# Altium project DCAC.PrjPcb (part 7 of 11)
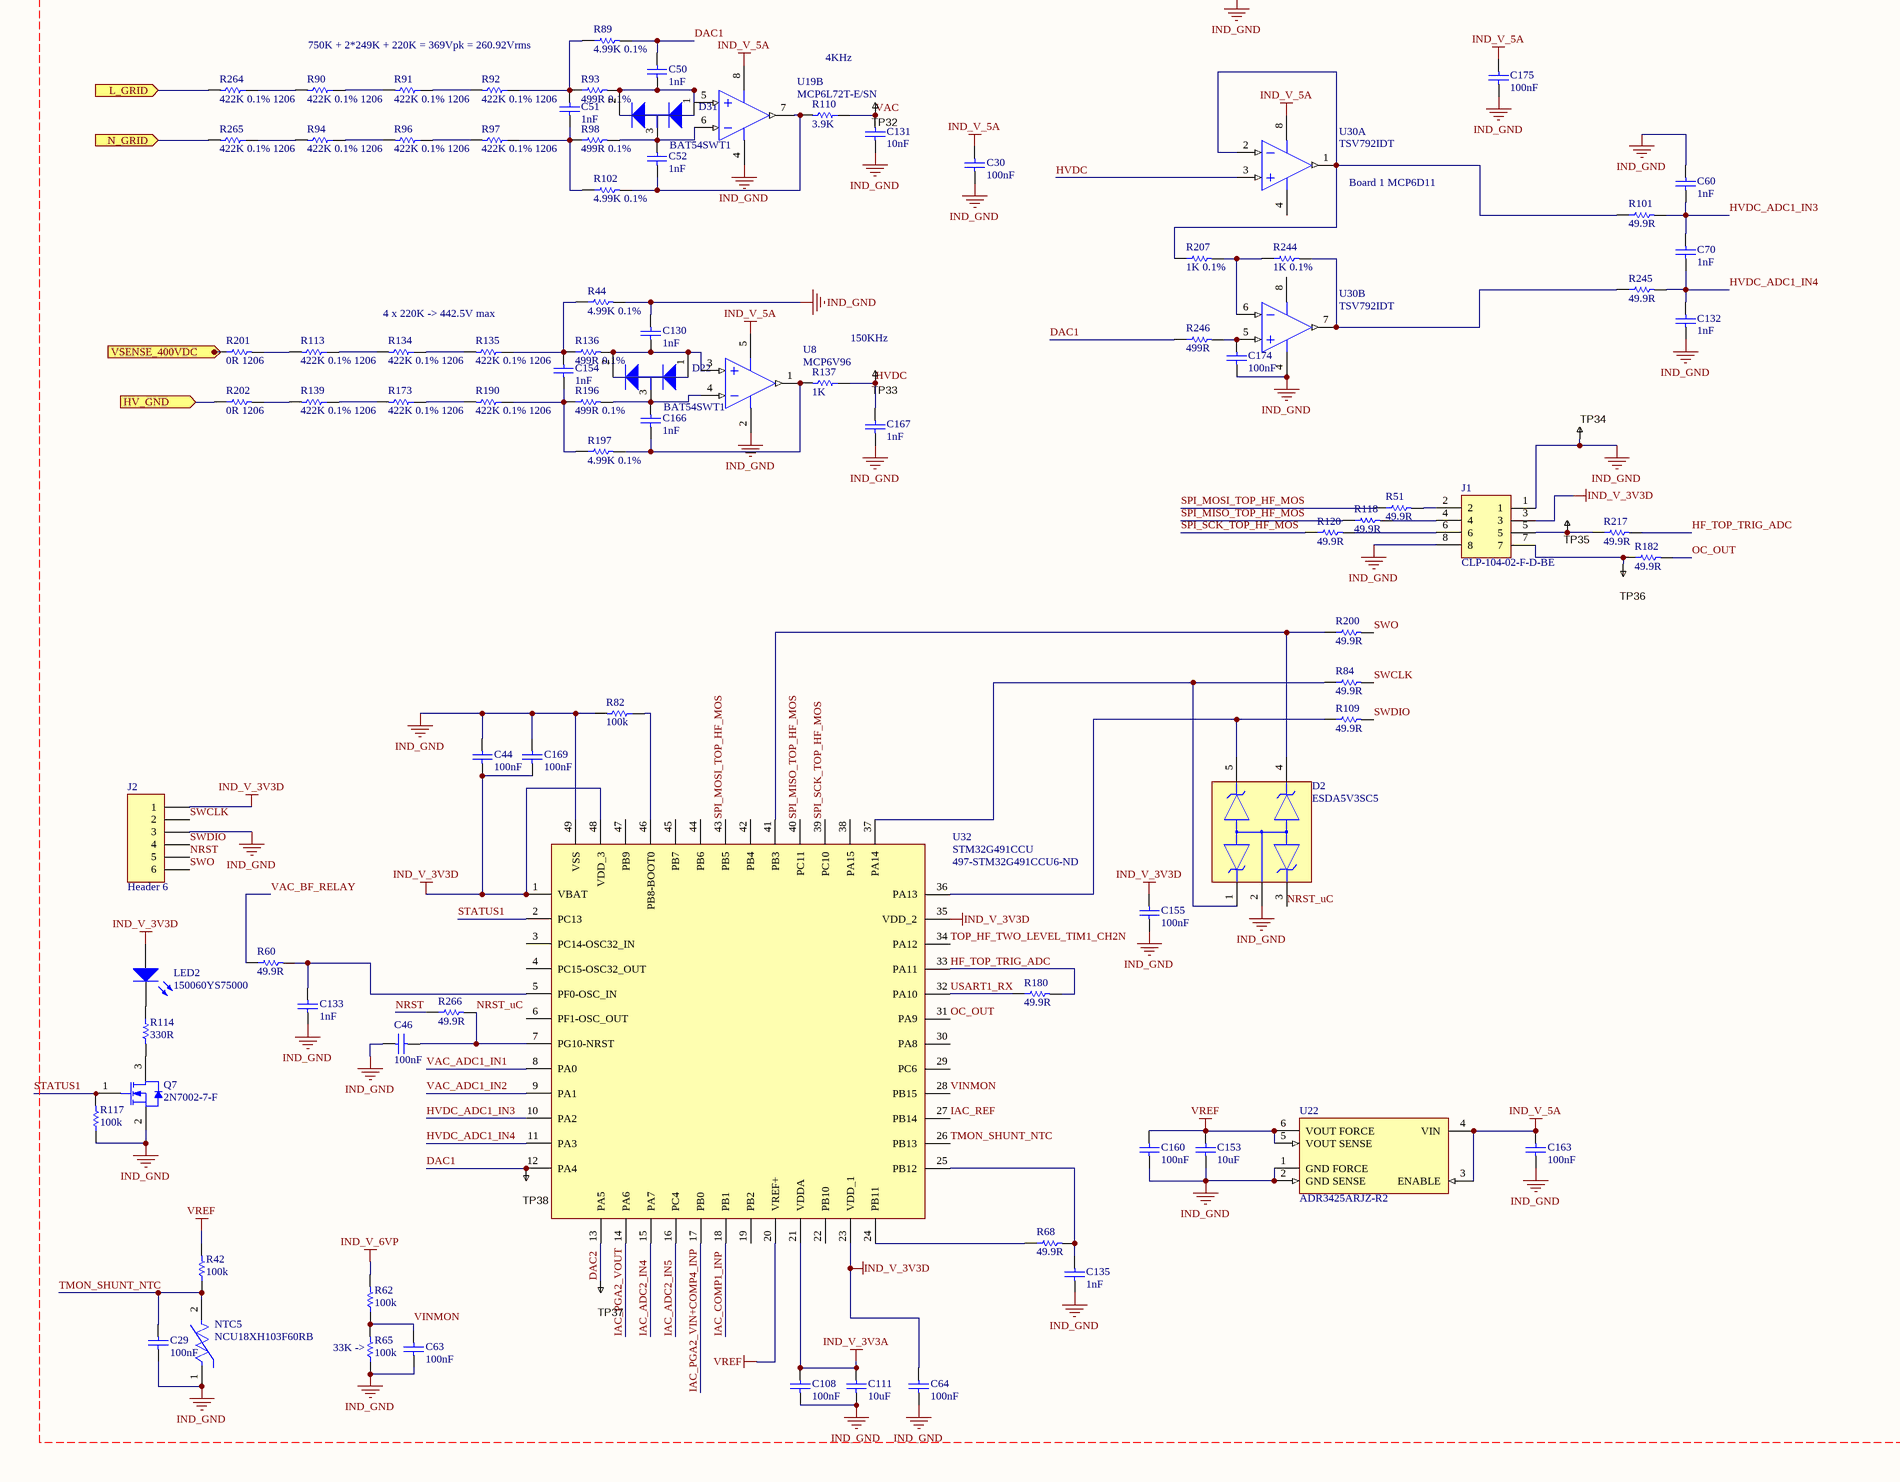
[diagram p17: IND_CURRENT_SENSE.SchDoc, bottom]

## Sheet IND_CURRENT_SENSE.SchDoc (continued)

### Library data of the parts (continued)
R40 R44 R89 R102 R194 R197 = CMP-2000-00123-1: Part Number: ERA3AEB752V; Manufacturer: Panasonic; Manufacturer Part Number: ERA-3AEB752V; Resistance: 7.5kR; Power Rating: 100mW; Temperature Coefficient: 25ppm/°C; Voltage Rating: 75V; Supplier 1: Newark; Supplier Part Number 1: 39P9989; RoHS: Yes; Category: Chip SMD Resistors; Stock 1: 4505; Pricing 1: 1=0.35700, 25=0.30700, 50=0.21600, 100=0.12400, 250=0.10000, 500=0.07500, 1000=0.05100 (USD); Mount: Surface Mount; Case/Package: 0603; Number of Pins: 2; Case Code (Metric): 1608; Case Code (Imperial): 0603; Contact Plating: Tin; Size Code: 0603; Min Operating Temperature: -55°C; Max Operating Temperature: 155°C; Packaging: Tape and Reel; Resistor Type: Thin Film; Number of Terminations: 2; Max Power Dissipation: 100mW; Series: ERA-3A; Tolerance: 0.1%; Package Quantity: 5000; Voltage Rating (DC): 75V; Resistance Tolerance: 0.1%; Termination: SMD/SMT; Construction: Rectangular; Technology: THIN FILM; Length: 1.6mm; Width: 0.8mm; Height: 0.45mm; Depth: 0.8mm; Radiation Hardening: No; RoHS Compliant: Yes; Lead Free: Lead Free; REACH SVHC: No SVHC; Military Standard: Not; ComponentLink1URL: https://datasheet.ciiva.com/29183/451204-da-01-en-widerstand-0603-era-29183801.pdf?src-supplier=Conrad; ComponentLink1Description: https://datasheet.ciiva.com/29183/451204-da-01-en-widerstand-0603-era-29183801.pdf?src-supplier=Conrad; ComponentLink2URL: https://datasheet.ciiva.com/5867/485442-5867989.pdf?src-supplier=Farnell; ComponentLink2Description: https://datasheet.ciiva.com/5867/485442-5867989.pdf?src-supplier=Farnell; ComponentLink3URL: https://datasheet.ciiva.com/30091/54aoa0000ce26-30091989.pdf?src-supplier=Onlinecomponents.com; ComponentLink3Description: https://datasheet.ciiva.com/30091/54aoa0000ce26-30091989.pdf?src-supplier=Onlinecomponents.com; ComponentLink4URL: https://datasheet.ciiva.com/46449/485442-46449462.pdf?src-supplier=Element14; ComponentLink4Description: https://datasheet.ciiva.com/46449/485442-46449462.pdf?src-supplier=Element14; ComponentLink5URL: https://datasheet.ciiva.com/16774/70068849-16774823.pdf?src-supplier=Allied+Electronics; ComponentLink5Description: https://datasheet.ciiva.com/16774/70068849-16774823.pdf?src-supplier=Allied+Electronics; ComponentLink6URL: https://datasheet.ciiva.com/5867/485442-5867992.pdf?src-supplier=Farnell; ComponentLink6Description: https://datasheet.ciiva.com/5867/485442-5867992.pdf?src-supplier=Farnell; ComponentLink7URL: https://datasheet.ciiva.com/16774/70068849-16774360.pdf?src-supplier=Allied+Electronics; ComponentLink7Description: https://datasheet.ciiva.com/16774/70068849-16774360.pdf?src-supplier=Allied+Electronics; ComponentLink8URL: https://datasheet.ciiva.com/46387/485442-46387291.pdf?src-supplier=Element14; ComponentLink8Description: https://datasheet.ciiva.com/46387/485442-46387291.pdf?src-supplier=Element14; ComponentLink9URL: https://datasheet.ciiva.com/9194/aoa0000ce26-9194812.pdf?src-supplier=Avnet; ComponentLink9Description: https://datasheet.ciiva.com/9194/aoa0000ce26-9194812.pdf?src-supplier=Avnet; ComponentLink10URL: https://datasheet.ciiva.com/46387/485442-46387292.pdf?src-supplier=Element14; ComponentLink10Description: https://datasheet.ciiva.com/46387/485442-46387292.pdf?src-supplier=Element14; ComponentLink11URL: https://datasheet.ciiva.com/17212/aoa0000ce26-17212461.pdf?src-supplier=Avnet+Europe; ComponentLink11Description: https://datasheet.ciiva.com/17212/aoa0000ce26-17212461.pdf?src-supplier=Avnet+Europe; ComponentLink12URL: https://datasheet.ciiva.com/22740/485442-22740941.pdf?src-supplier=Element14; ComponentLink12Description: https://datasheet.ciiva.com/22740/485442-22740941.pdf?src-supplier=Element14; ComponentLink13URL: https://datasheet.ciiva.com/16395/aoa0000ce26-16395263.pdf?src-supplier=Future+Electronics; ComponentLink13Description: https://datasheet.ciiva.com/16395/aoa0000ce26-16395263.pdf?src-supplier=Future+Electronics
R42 R62 R65 R82 = CMP-2000-00182-1: ±1% 100kΩ ±100ppm/℃ 0.1W 0603 Chip Resistor - Surface Mount ROHS; Part Number: ERJ-3EKF1003V; Manufacturer: Panasonic; Manufacturer Part Number: ERJ3EKF1003V; Resistance: 100kR; Power Rating: 100mW; Temperature Coefficient: 100ppm/°C; Voltage Rating: 75V; Supplier 1: Digi-Key; Supplier Part Number 1: P100KHCT-ND; RoHS: Yes; Category: Chip SMD Resistors; Stock 1: 2532776; Pricing 1: 1=0.10000, 10=0.05700, 100=0.02340, 1000=0.01049, 2500=0.00911 (USD); Mount: Surface Mount; Case/Package: 0603; Number of Pins: 2; Weight: 7.1E-05oz; Case Code (Imperial): 0603; Case Code (Metric): 1608; Contact Plating: Tin; Min Operating Temperature: -55°C; Max Operating Temperature: 155°C; Tolerance: 1%; Packaging: Tape and Reel; Composition: Thick Film; Termination: SMD/SMT; Package Quantity: 5000; Number of Terminations: 2; Max Power Dissipation: 100mW; Military Standard: Not; Voltage Rating (DC): 75V; Features: Automotive AEC-Q200; Length: 1.6mm; Height: 0.022inch; Width: 0.8mm; Depth: 0.8mm; Radiation Hardening: No; Lead Free: Lead Free; REACH SVHC: No SVHC; ComponentLink1URL: https://datasheet.ciiva.com/34303/1987476-34303566.pdf?src-supplier=Jameco; ComponentLink1Description: https://datasheet.ciiva.com/34303/1987476-34303566.pdf?src-supplier=Jameco; ComponentLink2URL: https://datasheet.ciiva.com/30133/aoa0000ce2-30133845.pdf?src-supplier=Onlinecomponents.com; ComponentLink2Description: https://datasheet.ciiva.com/30133/aoa0000ce2-30133845.pdf?src-supplier=Onlinecomponents.com; ComponentLink3URL: https://datasheet.ciiva.com/15158/getdatasheetpartid-247527-15158907.pdf?src-supplier=Verical; ComponentLink3Description: https://datasheet.ciiva.com/15158/getdatasheetpartid-247527-15158907.pdf?src-supplier=Verical; ComponentLink4URL: https://datasheet.ciiva.com/16770/70260748-16770253.pdf?src-supplier=Allied+Electronics; ComponentLink4Description: https://datasheet.ciiva.com/16770/70260748-16770253.pdf?src-supplier=Allied+Electronics; ComponentLink5URL: https://datasheet.ciiva.com/16740/aoa0000ce2-16740662.pdf?src-supplier=Future+Electronics; ComponentLink5Description: https://datasheet.ciiva.com/16740/aoa0000ce2-16740662.pdf?src-supplier=Future+Electronics; Supplier 2: Newark; Supplier Part Number 2: 85Y8503; Stock 2: 3015148; Pricing 2: 5000=0.02500, 10000=0.02400, 20000=0.01800 (USD); Size Code: 0603; Resistor Type: Thick Film; Series: ERJ; Resistance Tolerance: 1%; Construction: Rectangular; RoHS Compliant: Yes; JLCPCB Part #: C25803
R45-R47 R52 R56 R80 R90-R92 R94 R96 R97 R113 R134 R135 R139 R173 R190 = CMP-1014-00867-1: 1M5 0.25W 1% 1206 (3216 Metric)  SMD; Manufacturer: Yageo; Manufacturer Part Number: RT1206BRD07422KL; Case-EIA: 1206; Value: 1500000.00 Ohm; Case-Metric: 3216; Resistance: 422kR; Temperature Coefficient: 25ppm/°C; Power Rating: 250mW; Voltage Rating: 200V; Tolerance: 1 %; Power: 0.25 W; Technology: SMT; Supplier 1: Avnet; Supplier Part Number 1: RT1206BRD07422KL; RoHS: Yes; Category: Chip SMD Resistors; Pricing 1: 5000=0.04959, 10000=0.04889, 20000=0.04749, 30000=0.04644, 40000=0.04470, 50000=0.04365, 500000=0.04260 (USD); Case/Package: 1206; Case Code (Metric): 3216; Case Code (Imperial): 1206; Min Operating Temperature: -55°C; Max Operating Temperature: 125°C; Packaging: Tape and Reel; Series: RT; Number of Terminations: 2; Package Quantity: 5000; Max Power Dissipation: 250mW; Resistor Type: Thin Film; Termination: SMD/SMT; Voltage Rating (DC): 200V; Length: 0.122inch; Width: 0.063inch; Height: 0.026inch; RoHS Compliant: Yes; Lead Free: Lead Free; ComponentLink1URL: https://datasheet.ciiva.com/2587/pyu-rt-1-to-0-05-rohs-l-5-2587699.pdf?src-supplier=Digi-Key; ComponentLink1Description: https://datasheet.ciiva.com/2587/pyu-rt-1-to-0-05-rohs-l-5-2587699.pdf?src-supplier=Digi-Key; ComponentLink2URL: https://datasheet.ciiva.com/12702/pyu-rt-1-to-0-05-rohs-l-4-12702650.pdf?src-supplier=Mouser; ComponentLink2Description: https://datasheet.ciiva.com/12702/pyu-rt-1-to-0-05-rohs-l-4-12702650.pdf?src-supplier=Mouser
R49 R83 R93 R98 R136 R196 = CMP-2000-00076-1: Res Thin Film 0603 499 Ohm 0.1% 1/10W ±25ppm/°C Molded SMD SMD Punched Carrier T/R; Part Number: ERA3AEB4990V; Manufacturer: Panasonic; Manufacturer Part Number: ERA-3AEB4990V; Power Rating: 100mW; Voltage Rating: 150V; Voltage Rating (DC): 75V; Supplier 1: Digi-Key; Supplier Part Number 1: P499DBCT-ND; RoHS: Yes; Category: Chip SMD Resistors; Stock 1: 51561; Pricing 1: 1=0.31000, 10=0.26000, 100=0.10150, 1000=0.04248, 2500=0.03894 (USD); Mount: Surface Mount; Case/Package: 0603; Number of Pins: 2; Case Code (Metric): 1608; Case Code (Imperial): 0603; Contact Plating: Tin; Min Operating Temperature: -55°C; Max Operating Temperature: 155°C; Resistance: 499R; Tolerance: 0.1%; Packaging: Tape and Reel; Resistor Type: Thin Film,Metal Film; Temperature Coefficient: 25ppm/°C; Package Quantity: 1; Number of Terminations: 2; Termination: SMD/SMT; Max Power Dissipation: 100mW; Series: ERA-3A; Resistance Tolerance: 0.1%; Construction: Rectangular; Features: Automotive AEC-Q200; Technology: METAL FILM; Length: 1.6mm; Width: 0.8mm; Height: 0.45mm; Depth: 0.8mm; Radiation Hardening: No; RoHS Compliant: Yes; Lead Free: Lead Free; REACH SVHC: No SVHC; Military Standard: Not; ComponentLink1URL: https://datasheet.ciiva.com/11810/0900766b80eb1d8c-11810911.pdf?src-supplier=RSComponents; ComponentLink1Description: https://datasheet.ciiva.com/11810/0900766b80eb1d8c-11810911.pdf?src-supplier=RSComponents; ComponentLink2URL: https://datasheet.ciiva.com/29183/451973-da-01-en-widerstand-0603-era-29183924.pdf?src-supplier=Conrad; ComponentLink2Description: https://datasheet.ciiva.com/29183/451973-da-01-en-widerstand-0603-era-29183924.pdf?src-supplier=Conrad; ComponentLink3URL: https://datasheet.ciiva.com/9181/aoa0000ce26-9181477.pdf?src-supplier=Avnet; ComponentLink3Description: https://datasheet.ciiva.com/9181/aoa0000ce26-9181477.pdf?src-supplier=Avnet; ComponentLink4URL: https://datasheet.ciiva.com/17205/aoa0000ce26-17205477.pdf?src-supplier=Avnet+Europe; ComponentLink4Description: https://datasheet.ciiva.com/17205/aoa0000ce26-17205477.pdf?src-supplier=Avnet+Europe; ComponentLink5URL: https://datasheet.ciiva.com/30161/54aoa0000ce26-30161593.pdf?src-supplier=Onlinecomponents.com; ComponentLink5Description: https://datasheet.ciiva.com/30161/54aoa0000ce26-30161593.pdf?src-supplier=Onlinecomponents.com; ComponentLink6URL: https://datasheet.ciiva.com/7920/485442-7920378.pdf?src-supplier=Element14; ComponentLink6Description: https://datasheet.ciiva.com/7920/485442-7920378.pdf?src-supplier=Element14; ComponentLink7URL: https://datasheet.ciiva.com/7920/485442-7920379.pdf?src-supplier=Element14; ComponentLink7Description: https://datasheet.ciiva.com/7920/485442-7920379.pdf?src-supplier=Element14; ComponentLink8URL: https://datasheet.ciiva.com/6201/485442-6201036.pdf?src-supplier=Farnell; ComponentLink8Description: https://datasheet.ciiva.com/6201/485442-6201036.pdf?src-supplier=Farnell
R58 R77 = RES: Resistor, SMD 30 kOhm 0603  ±  0.1 %, ERA3AEB303V, Panasonic Automotive & Industrial Systems; Manufacturer Part Number: ERA-3AEB303V; Power Rating: 100mW; Voltage Rating: 75V; Resistance: 30kR; Temperature Coefficient: 25ppm/°C; Manufacturer: Panasonic; Part Number: ERA3AEB303V; Supplier 1: Avnet; Supplier Part Number 1: ERA-3AEB303V; RoHS: Yes; Category: Chip SMD Resistors; Stock 1: 26; Pricing 1: 1=0.03536, 157=0.03482, 313=0.03427, 625=0.03373, 1250=0.03318, 2500=0.03264, 5000=0.03210 (USD); Mount: Surface Mount; Case/Package: 0603; Number of Pins: 2; Case Code (Metric): 1608; Case Code (Imperial): 0603; Size Code: 0603; Contact Plating: Tin; Min Operating Temperature: -55°C; Max Operating Temperature: 155°C; Tolerance: 0.1%; Packaging: Tape and Reel; Resistor Type: Thin Film; Series: ERA-3A; Termination: SMD/SMT; Number of Terminations: 2; Max Power Dissipation: 100mW; Features: Automotive AEC-Q200; Package Quantity: 1; Resistance Tolerance: 0.1%; Construction: Rectangular; Technology: THIN FILM; Length: 1.6mm; Width: 0.8mm; Height: 0.45mm; Depth: 0.8mm; Radiation Hardening: No; RoHS Compliant: Yes; REACH SVHC: No SVHC; Military Standard: Not; ComponentLink1URL: https://datasheet.ciiva.com/29183/451408-da-01-en-widerstand-0603-era-29183835.pdf?src-supplier=Conrad; ComponentLink1Description: https://datasheet.ciiva.com/29183/451408-da-01-en-widerstand-0603-era-29183835.pdf?src-supplier=Conrad; ComponentLink2URL: https://datasheet.ciiva.com/5917/485442-5917669.pdf?src-supplier=Farnell; ComponentLink2Description: https://datasheet.ciiva.com/5917/485442-5917669.pdf?src-supplier=Farnell; ComponentLink3URL: https://datasheet.ciiva.com/16212/aoa0000ce26-16212101.pdf?src-supplier=Future+Electronics; ComponentLink3Description: https://datasheet.ciiva.com/16212/aoa0000ce26-16212101.pdf?src-supplier=Future+Electronics; ComponentLink4URL: https://datasheet.ciiva.com/43455/485442-43455381.pdf?src-supplier=Farnell; ComponentLink4Description: https://datasheet.ciiva.com/43455/485442-43455381.pdf?src-supplier=Farnell; ComponentLink5URL: https://datasheet.ciiva.com/30073/54aoa0000ce26-30073910.pdf?src-supplier=Onlinecomponents.com; ComponentLink5Description: https://datasheet.ciiva.com/30073/54aoa0000ce26-30073910.pdf?src-supplier=Onlinecomponents.com; ComponentLink6URL: https://datasheet.ciiva.com/9190/aoa0000ce26-9190919.pdf?src-supplier=Avnet; ComponentLink6Description: https://datasheet.ciiva.com/9190/aoa0000ce26-9190919.pdf?src-supplier=Avnet; ComponentLink7URL: https://datasheet.ciiva.com/16759/70068849-16759447.pdf?src-supplier=Allied+Electronics; ComponentLink7Description: https://datasheet.ciiva.com/16759/70068849-16759447.pdf?src-supplier=Allied+Electronics; ComponentLink8URL: https://datasheet.ciiva.com/17210/aoa0000ce26-17210455.pdf?src-supplier=Avnet+Europe; ComponentLink8Description: https://datasheet.ciiva.com/17210/aoa0000ce26-17210455.pdf?src-supplier=Avnet+Europe; ComponentLink9URL: https://datasheet.ciiva.com/22740/485442-22740936.pdf?src-supplier=Element14; ComponentLink9Description: https://datasheet.ciiva.com/22740/485442-22740936.pdf?src-supplier=Element14; ComponentLink10URL: https://datasheet.ciiva.com/43457/485442-43457880.pdf?src-supplier=Farnell; ComponentLink10Description: https://datasheet.ciiva.com/43457/485442-43457880.pdf?src-supplier=Farnell; ComponentLink11URL: https://datasheet.ciiva.com/48425/era-eng-tds-48425453.pdf?src-supplier=Distrelec; ComponentLink11Description: https://datasheet.ciiva.com/48425/era-eng-tds-48425453.pdf?src-supplier=Distrelec
R59 R110 R254 = RES: ±1% 3.9kΩ ±100ppm/℃ 0.1W 0603 Chip Resistor - Surface Mount ROHS; Part Number: ERJ-3EKF1001V; Manufacturer: Panasonic; Manufacturer Part Number: ERJ3EKF1001V; Resistance: 1kR; Power Rating: 100mW; Voltage Rating: 75V; Temperature Coefficient: 100ppm/°C; Supplier 1: Future Electronics; Supplier Part Number 1: 3028514; RoHS: Yes; Category: Chip SMD Resistors; Stock 1: 430000; Pricing 1: 5000=0.01860, 10000=0.01510, 15000=0.01500, 20000=0.01490 (USD); Mount: Surface Mount; Case/Package: 0603; Number of Pins: 2; Case Code (Metric): 1608; Case Code (Imperial): 0603; Contact Plating: Tin; Size Code: 0603; Min Operating Temperature: -55°C; Max Operating Temperature: 155°C; Packaging: Tape and Reel; Tolerance: 1%; Termination: SMD/SMT; Package Quantity: 5000; Series: ERJ; Resistor Type: Thick Film; Max Power Dissipation: 100mW; Construction: Rectangular; Resistance Tolerance: 1%; Number of Terminations: 2; Features: Automotive AEC-Q200; Voltage Rating (DC): 75V; Technology: THICK FILM; Length: 1.6mm; Width: 0.8mm; Height: 0.45mm; Depth: 0.8mm; Radiation Hardening: No; REACH SVHC: No SVHC; Lead Free: Lead Free; RoHS Compliant: Yes; Military Standard: Not; ComponentLink1URL: https://datasheet.ciiva.com/16768/70260748-16768437.pdf?src-supplier=Allied+Electronics; ComponentLink1Description: https://datasheet.ciiva.com/16768/70260748-16768437.pdf?src-supplier=Allied+Electronics; ComponentLink2URL: https://datasheet.ciiva.com/16774/70260748-16774550.pdf?src-supplier=Allied+Electronics; ComponentLink2Description: https://datasheet.ciiva.com/16774/70260748-16774550.pdf?src-supplier=Allied+Electronics; ComponentLink3URL: https://datasheet.ciiva.com/16449/aoa0000ce2-16449065.pdf?src-supplier=Future+Electronics; ComponentLink3Description: https://datasheet.ciiva.com/16449/aoa0000ce2-16449065.pdf?src-supplier=Future+Electronics; ComponentLink4URL: https://datasheet.ciiva.com/7942/aoa0000ce2-7942427.pdf?src-supplier=Element14; ComponentLink4Description: https://datasheet.ciiva.com/7942/aoa0000ce2-7942427.pdf?src-supplier=Element14; ComponentLink5URL: https://datasheet.ciiva.com/9198/aoa0000ce2-9198923.pdf?src-supplier=Avnet; ComponentLink5Description: https://datasheet.ciiva.com/9198/aoa0000ce2-9198923.pdf?src-supplier=Avnet; ComponentLink6URL: https://datasheet.ciiva.com/46373/1678782-46373339.pdf?src-supplier=Element14; ComponentLink6Description: https://datasheet.ciiva.com/46373/1678782-46373339.pdf?src-supplier=Element14; ComponentLink7URL: https://datasheet.ciiva.com/48530/aoa0000ce2-48530987.pdf?src-supplier=Avnet; ComponentLink7Description: https://datasheet.ciiva.com/48530/aoa0000ce2-48530987.pdf?src-supplier=Avnet; ComponentLink8URL: https://datasheet.ciiva.com/46373/1678782-46373340.pdf?src-supplier=Element14; ComponentLink8Description: https://datasheet.ciiva.com/46373/1678782-46373340.pdf?src-supplier=Element14; ComponentLink9URL: https://datasheet.ciiva.com/24070/aoa0000ce2-24070269.pdf?src-supplier=Mouser; ComponentLink9Description: https://datasheet.ciiva.com/24070/aoa0000ce2-24070269.pdf?src-supplier=Mouser; ComponentLink10URL: https://datasheet.ciiva.com/22673/1678782-22673918.pdf?src-supplier=Element14; ComponentLink10Description: https://datasheet.ciiva.com/22673/1678782-22673918.pdf?src-supplier=Element14; ComponentLink11URL: https://datasheet.ciiva.com/30063/aoa0000ce2-30063390.pdf?src-supplier=Onlinecomponents.com; ComponentLink11Description: https://datasheet.ciiva.com/30063/aoa0000ce2-30063390.pdf?src-supplier=Onlinecomponents.com; ComponentLink12URL: https://datasheet.ciiva.com/17215/aoa0000ce2-17215311.pdf?src-supplier=Avnet+Europe; ComponentLink12Description: https://datasheet.ciiva.com/17215/aoa0000ce2-17215311.pdf?src-supplier=Avnet+Europe; Parameter 1: *; JLCPCB Part #: C23018
R64 R75 = RES: Res Thin Film 0603 499 Ohm 0.1% 1/10W ±25ppm/°C Molded SMD SMD Punched Carrier T/R; Part Number: ERA3AEB4990V; Manufacturer: Panasonic; Manufacturer Part Number: ERA-3AEB4990V; Power Rating: 100mW; Voltage Rating: 150V; Voltage Rating (DC): 75V; Supplier 1: Digi-Key; Supplier Part Number 1: P499DBCT-ND; RoHS: Yes; Category: Chip SMD Resistors; Stock 1: 51561; Pricing 1: 1=0.31000, 10=0.26000, 100=0.10150, 1000=0.04248, 2500=0.03894 (USD); Mount: Surface Mount; Case/Package: 0603; Number of Pins: 2; Case Code (Metric): 1608; Case Code (Imperial): 0603; Contact Plating: Tin; Min Operating Temperature: -55°C; Max Operating Temperature: 155°C; Resistance: 499R; Tolerance: 0.1%; Packaging: Tape and Reel; Resistor Type: Thin Film,Metal Film; Temperature Coefficient: 25ppm/°C; Package Quantity: 1; Number of Terminations: 2; Termination: SMD/SMT; Max Power Dissipation: 100mW; Series: ERA-3A; Resistance Tolerance: 0.1%; Construction: Rectangular; Features: Automotive AEC-Q200; Technology: METAL FILM; Length: 1.6mm; Width: 0.8mm; Height: 0.45mm; Depth: 0.8mm; Radiation Hardening: No; RoHS Compliant: Yes; Lead Free: Lead Free; REACH SVHC: No SVHC; Military Standard: Not; ComponentLink1URL: https://datasheet.ciiva.com/11810/0900766b80eb1d8c-11810911.pdf?src-supplier=RSComponents; ComponentLink1Description: https://datasheet.ciiva.com/11810/0900766b80eb1d8c-11810911.pdf?src-supplier=RSComponents; ComponentLink2URL: https://datasheet.ciiva.com/29183/451973-da-01-en-widerstand-0603-era-29183924.pdf?src-supplier=Conrad; ComponentLink2Description: https://datasheet.ciiva.com/29183/451973-da-01-en-widerstand-0603-era-29183924.pdf?src-supplier=Conrad; ComponentLink3URL: https://datasheet.ciiva.com/9181/aoa0000ce26-9181477.pdf?src-supplier=Avnet; ComponentLink3Description: https://datasheet.ciiva.com/9181/aoa0000ce26-9181477.pdf?src-supplier=Avnet; ComponentLink4URL: https://datasheet.ciiva.com/17205/aoa0000ce26-17205477.pdf?src-supplier=Avnet+Europe; ComponentLink4Description: https://datasheet.ciiva.com/17205/aoa0000ce26-17205477.pdf?src-supplier=Avnet+Europe; ComponentLink5URL: https://datasheet.ciiva.com/30161/54aoa0000ce26-30161593.pdf?src-supplier=Onlinecomponents.com; ComponentLink5Description: https://datasheet.ciiva.com/30161/54aoa0000ce26-30161593.pdf?src-supplier=Onlinecomponents.com; ComponentLink6URL: https://datasheet.ciiva.com/7920/485442-7920378.pdf?src-supplier=Element14; ComponentLink6Description: https://datasheet.ciiva.com/7920/485442-7920378.pdf?src-supplier=Element14; ComponentLink7URL: https://datasheet.ciiva.com/7920/485442-7920379.pdf?src-supplier=Element14; ComponentLink7Description: https://datasheet.ciiva.com/7920/485442-7920379.pdf?src-supplier=Element14; ComponentLink8URL: https://datasheet.ciiva.com/6201/485442-6201036.pdf?src-supplier=Farnell; ComponentLink8Description: https://datasheet.ciiva.com/6201/485442-6201036.pdf?src-supplier=Farnell
R114 = RES-2: ±1% 330Ω ±100ppm/℃ 0.1W 0603 Chip Resistor - Surface Mount ROHS; Manufacturer: Yageo; Manufacturer Part Number: RC0603FR-07330RL; Tolerance: 10%; ESR: 800 mohm; Voltage Rating (DC): 16 V; Capacitance: 47 uF; Temperature Coefficient: 100ppm/°C; Power Rating: 100mW; Length: 7.3 mm; ComponentLink1URL: http://www.yageo.com/; Packaging: Tape and Reel; Pins: 2; ComponentLink1Description: Manufacturer URL; Case Code (Imperial): 2917; REACH SVHC: No SVHC; Width: 4.3 mm; ComponentLink2Description: Datasheet; Voltage Rating: 16 V; RoHSCompliant: True; Max Operating Temperature: 125degC; ComponentLink2URL: http://www.yageo.com/documents/recent/PYu-RC_Group_51_RoHS_L_04.pdf; Min Operating Temperature: -55degC; Case/Package: 2917; Radiation Hardening: No; DatasheetVersion: Rev. 4, 02/2016; Mount: Surface Mount; PackageReference: 0603; Package Quantity: 500; Case Code (Metric): 7343; PackageDescription: 2-Pin Surface Mount Device, Body 1.6 x 0.8 mm; Height: 3.1 mm; Supplier 1: Digi-Key; Supplier Part Number 1: 311-330HRCT-ND; RoHS: Yes; Category: Chip SMD Resistors; Stock 1: 4209654; Pricing 1: 1=0.10000, 10=0.02300, 100=0.00940, 1000=0.00421, 2500=0.00366 (USD); Number of Pins: 2; Composition: Thick Film; Resistance: 330R; Number of Terminations: 2; Max Power Dissipation: 100mW; Termination: SMD/SMT; Features: Moisture Resistant; Depth: 0.8mm; Lead Free: Lead Free; ComponentLink3URL: https://datasheet.ciiva.com/11819/0900766b80f96399-11819327.pdf?src-supplier=RSComponents; ComponentLink3Description: https://datasheet.ciiva.com/11819/0900766b80f96399-11819327.pdf?src-supplier=RSComponents; ComponentLink4URL: https://datasheet.ciiva.com/2454/pyu-r-int-thick-7-2454864.pdf?src-supplier=Digi-Key; ComponentLink4Description: https://datasheet.ciiva.com/2454/pyu-r-int-thick-7-2454864.pdf?src-supplier=Digi-Key; ComponentLink5URL: https://datasheet.ciiva.com/2454/pyu-r-int-thick-7-2454865.pdf?src-supplier=Digi-Key; ComponentLink5Description: https://datasheet.ciiva.com/2454/pyu-r-int-thick-7-2454865.pdf?src-supplier=Digi-Key; ComponentLink6URL: https://datasheet.ciiva.com/2454/pyu-r-int-thick-7-2454866.pdf?src-supplier=Digi-Key; ComponentLink6Description: https://datasheet.ciiva.com/2454/pyu-r-int-thick-7-2454866.pdf?src-supplier=Digi-Key; ComponentLink7URL: https://datasheet.ciiva.com/12555/rc0603-272842-12555334.pdf?src-supplier=Mouser; ComponentLink7Description: https://datasheet.ciiva.com/12555/rc0603-272842-12555334.pdf?src-supplier=Mouser; ComponentLink8URL: https://datasheet.ciiva.com/46440/1868787-46440904.pdf?src-supplier=Element14; ComponentLink8Description: https://datasheet.ciiva.com/46440/1868787-46440904.pdf?src-supplier=Element14; ComponentLink9URL: https://datasheet.ciiva.com/7746/443971-7746329.pdf?src-supplier=Element14; ComponentLink9Description: https://datasheet.ciiva.com/7746/443971-7746329.pdf?src-supplier=Element14; ComponentLink10URL: https://datasheet.ciiva.com/7746/443971-7746330.pdf?src-supplier=Element14; ComponentLink10Description: https://datasheet.ciiva.com/7746/443971-7746330.pdf?src-supplier=Element14; ComponentLink11URL: https://datasheet.ciiva.com/7746/1686128-7746331.pdf?src-supplier=Element14; ComponentLink11Description: https://datasheet.ciiva.com/7746/1686128-7746331.pdf?src-supplier=Element14; Parameter 1: *; JLCPCB Part #: C23138
R117 = RES: ±1% 100kΩ ±100ppm/℃ 0.1W 0603 Chip Resistor - Surface Mount ROHS; Part Number: ERJ-3EKF1003V; Manufacturer: Panasonic; Manufacturer Part Number: ERJ3EKF1003V; Resistance: 100kR; Power Rating: 100mW; Temperature Coefficient: 100ppm/°C; Voltage Rating: 75V; Supplier 1: Digi-Key; Supplier Part Number 1: P100KHCT-ND; RoHS: Yes; Category: Chip SMD Resistors; Stock 1: 2532776; Pricing 1: 1=0.10000, 10=0.05700, 100=0.02340, 1000=0.01049, 2500=0.00911 (USD); Mount: Surface Mount; Case/Package: 0603; Number of Pins: 2; Weight: 7.1E-05oz; Case Code (Imperial): 0603; Case Code (Metric): 1608; Contact Plating: Tin; Min Operating Temperature: -55°C; Max Operating Temperature: 155°C; Tolerance: 1%; Packaging: Tape and Reel; Composition: Thick Film; Termination: SMD/SMT; Package Quantity: 5000; Number of Terminations: 2; Max Power Dissipation: 100mW; Military Standard: Not; Voltage Rating (DC): 75V; Features: Automotive AEC-Q200; Length: 1.6mm; Height: 0.022inch; Width: 0.8mm; Depth: 0.8mm; Radiation Hardening: No; Lead Free: Lead Free; REACH SVHC: No SVHC; ComponentLink1URL: https://datasheet.ciiva.com/34303/1987476-34303566.pdf?src-supplier=Jameco; ComponentLink1Description: https://datasheet.ciiva.com/34303/1987476-34303566.pdf?src-supplier=Jameco; ComponentLink2URL: https://datasheet.ciiva.com/30133/aoa0000ce2-30133845.pdf?src-supplier=Onlinecomponents.com; ComponentLink2Description: https://datasheet.ciiva.com/30133/aoa0000ce2-30133845.pdf?src-supplier=Onlinecomponents.com; ComponentLink3URL: https://datasheet.ciiva.com/15158/getdatasheetpartid-247527-15158907.pdf?src-supplier=Verical; ComponentLink3Description: https://datasheet.ciiva.com/15158/getdatasheetpartid-247527-15158907.pdf?src-supplier=Verical; ComponentLink4URL: https://datasheet.ciiva.com/16770/70260748-16770253.pdf?src-supplier=Allied+Electronics; ComponentLink4Description: https://datasheet.ciiva.com/16770/70260748-16770253.pdf?src-supplier=Allied+Electronics; ComponentLink5URL: https://datasheet.ciiva.com/16740/aoa0000ce2-16740662.pdf?src-supplier=Future+Electronics; ComponentLink5Description: https://datasheet.ciiva.com/16740/aoa0000ce2-16740662.pdf?src-supplier=Future+Electronics; Supplier 2: Newark; Supplier Part Number 2: 85Y8503; Stock 2: 3015148; Pricing 2: 5000=0.02500, 10000=0.02400, 20000=0.01800 (USD); Size Code: 0603; Resistor Type: Thick Film; Series: ERJ; Resistance Tolerance: 1%; Construction: Rectangular; RoHS Compliant: Yes; JLCPCB Part #: C25803
R201 R202 = CMP-2003-00541-1: Manufacturer: Panasonic; Part Number: ERJ-8GEY0R00V
R204 = RES: RES SMD 1K OHM 0.1% 1/10W 0603; Part Number: RT0603BRE071KL; Manufacturer: Yageo; Resistance: 1kR; Power Rating: 100mW; Temperature Coefficient: 50ppm/°C; Voltage Rating (DC): 50V; Supplier 1: Digi-Key; Supplier Part Number 1: YAG2314CT-ND; Manufacturer Part Number: RT0603BRE071KL; RoHS: Yes; Category: Chip SMD Resistors; Stock 1: 173; Pricing 1: 1=0.38000, 10=0.27500, 100=0.11000, 1000=0.05420, 2500=0.05021 (USD); Case/Package: 0603; Case Code (Metric): 1608; Case Code (Imperial): 0603; Size Code: 0603; Min Operating Temperature: -55°C; Max Operating Temperature: 155°C; Packaging: Tape and Reel; Resistor Type: Thin Film; Tolerance: 0.1%; Number of Terminations: 2; Series: RT; Max Power Dissipation: 100mW; Construction: Rectangular; Package Quantity: 5000; Features: Moisture Resistant; Length: 0.063inch; Width: 0.031inch; Height: 0.022inch; Depth: 0.8mm; RoHS Compliant: Yes; Military Standard: Not; Lead Free: Lead Free; ComponentLink1URL: https://datasheet.ciiva.com/2584/pyu-rt-1-to-0-05-rohs-l-5-2584317.pdf?src-supplier=Digi-Key; ComponentLink1Description: https://datasheet.ciiva.com/2584/pyu-rt-1-to-0-05-rohs-l-5-2584317.pdf?src-supplier=Digi-Key
R255 = RES: ±1% ±200ppm/℃ 0.1W 49.9Ω 0603 Chip Resistor - Surface Mount ROHS; Manufacturer: Panasonic; Part Number: ERJ-3EKF49R9V; Manufacturer Part Number: ERJ3EKF49R9V; Power Rating: 100mW; Voltage Rating: 75V; Temperature Coefficient: 100ppm/°C; Voltage Rating (DC): 50V; Working Voltage: 6V; Supplier 1: RSComponents; Supplier Part Number 1: 1229343; RoHS: Yes; Category: Chip SMD Resistors; Stock 1: 1; Pricing 1: 5000=0.00700 (USD); Mount: Surface Mount; Case/Package: 0603; Case Code (Imperial): 0603; Case Code (Metric): 1608; Contact Plating: Tin; Min Operating Temperature: -55°C; Max Operating Temperature: 155°C; Packaging: Tape and Reel; Resistance: 49.9R; Tolerance: 1%; Resistor Type: Thick Film; Number of Terminations: 2; Termination: SMD/SMT; Max Power Dissipation: 100mW; Series: ERJ; Package Quantity: 5000; Resistance Tolerance: 1%; Features: Automotive AEC-Q200; Construction: Rectangular; Technology: THICK FILM; Length: 1.6mm; Width: 0.8mm; Height: 0.022inch; Depth: 0.8mm; Radiation Hardening: No; REACH SVHC: Unknown; Lead Free: Lead Free; RoHS Compliant: Yes; Military Standard: Not; ComponentLink1URL: https://datasheet.ciiva.com/46388/1678782-46388908.pdf?src-supplier=Element14; ComponentLink1Description: https://datasheet.ciiva.com/46388/1678782-46388908.pdf?src-supplier=Element14; ComponentLink2URL: https://datasheet.ciiva.com/28694/1678782-28694219.pdf?src-supplier=Element14; ComponentLink2Description: https://datasheet.ciiva.com/28694/1678782-28694219.pdf?src-supplier=Element14; ComponentLink3URL: https://datasheet.ciiva.com/16772/70260748-16772570.pdf?src-supplier=Allied+Electronics; ComponentLink3Description: https://datasheet.ciiva.com/16772/70260748-16772570.pdf?src-supplier=Allied+Electronics; ComponentLink4URL: https://datasheet.ciiva.com/16766/70260748-16766262.pdf?src-supplier=Allied+Electronics; ComponentLink4Description: https://datasheet.ciiva.com/16766/70260748-16766262.pdf?src-supplier=Allied+Electronics; ComponentLink5URL: https://datasheet.ciiva.com/9117/aoa0000ce2-9117128.pdf?src-supplier=Avnet; ComponentLink5Description: https://datasheet.ciiva.com/9117/aoa0000ce2-9117128.pdf?src-supplier=Avnet; ComponentLink6URL: https://datasheet.ciiva.com/48531/aoa0000ce2-48531019.pdf?src-supplier=Avnet; ComponentLink6Description: https://datasheet.ciiva.com/48531/aoa0000ce2-48531019.pdf?src-supplier=Avnet; ComponentLink7URL: https://datasheet.ciiva.com/30095/aoa0000ce2-30095355.pdf?src-supplier=Onlinecomponents.com; ComponentLink7Description: https://datasheet.ciiva.com/30095/aoa0000ce2-30095355.pdf?src-supplier=Onlinecomponents.com; Parameter 1: *; JLCPCB Part #: C23185
R260 R261 R264 R265 = RES: 1M5 0.25W 1% 1206 (3216 Metric)  SMD; Manufacturer: Yageo; Manufacturer Part Number: RT1206BRD07422KL; Case-EIA: 1206; Value: 1500000.00 Ohm; Case-Metric: 3216; Resistance: 422kR; Temperature Coefficient: 25ppm/°C; Power Rating: 250mW; Voltage Rating: 200V; Tolerance: 1 %; Power: 0.25 W; Technology: SMT; Supplier 1: Avnet; Supplier Part Number 1: RT1206BRD07422KL; RoHS: Yes; Category: Chip SMD Resistors; Pricing 1: 5000=0.04959, 10000=0.04889, 20000=0.04749, 30000=0.04644, 40000=0.04470, 50000=0.04365, 500000=0.04260 (USD); Case/Package: 1206; Case Code (Metric): 3216; Case Code (Imperial): 1206; Min Operating Temperature: -55°C; Max Operating Temperature: 125°C; Packaging: Tape and Reel; Series: RT; Number of Terminations: 2; Package Quantity: 5000; Max Power Dissipation: 250mW; Resistor Type: Thin Film; Termination: SMD/SMT; Voltage Rating (DC): 200V; Length: 0.122inch; Width: 0.063inch; Height: 0.026inch; RoHS Compliant: Yes; Lead Free: Lead Free; ComponentLink1URL: https://datasheet.ciiva.com/2587/pyu-rt-1-to-0-05-rohs-l-5-2587699.pdf?src-supplier=Digi-Key; ComponentLink1Description: https://datasheet.ciiva.com/2587/pyu-rt-1-to-0-05-rohs-l-5-2587699.pdf?src-supplier=Digi-Key; ComponentLink2URL: https://datasheet.ciiva.com/12702/pyu-rt-1-to-0-05-rohs-l-4-12702650.pdf?src-supplier=Mouser; ComponentLink2Description: https://datasheet.ciiva.com/12702/pyu-rt-1-to-0-05-rohs-l-4-12702650.pdf?src-supplier=Mouser
R266 = RES: 1/16W ±1% ±200ppm/℃ 49.9Ω 0402 Chip Resistor - Surface Mount ROHS; Manufacturer: Panasonic; Part Number: ERJ-2RKF49R9X; JLCPCB Part #: C25120
R267 = RES: RES SMD 1.5K OHM 0.1% 1/10W 0603; Part Number: RT0603BRE071KL; Manufacturer: Yageo; Resistance: 1kR; Power Rating: 100mW; Temperature Coefficient: 50ppm/°C; Voltage Rating (DC): 50V; Supplier 1: Digi-Key; Supplier Part Number 1: YAG2314CT-ND; Manufacturer Part Number: RT0603BRE071KL; RoHS: Yes; Category: Chip SMD Resistors; Stock 1: 173; Pricing 1: 1=0.38000, 10=0.27500, 100=0.11000, 1000=0.05420, 2500=0.05021 (USD); Case/Package: 0603; Case Code (Metric): 1608; Case Code (Imperial): 0603; Size Code: 0603; Min Operating Temperature: -55°C; Max Operating Temperature: 155°C; Packaging: Tape and Reel; Resistor Type: Thin Film; Tolerance: 0.1%; Number of Terminations: 2; Series: RT; Max Power Dissipation: 100mW; Construction: Rectangular; Package Quantity: 5000; Features: Moisture Resistant; Length: 0.063inch; Width: 0.031inch; Height: 0.022inch; Depth: 0.8mm; RoHS Compliant: Yes; Military Standard: Not; Lead Free: Lead Free; ComponentLink1URL: https://datasheet.ciiva.com/2584/pyu-rt-1-to-0-05-rohs-l-5-2584317.pdf?src-supplier=Digi-Key; ComponentLink1Description: https://datasheet.ciiva.com/2584/pyu-rt-1-to-0-05-rohs-l-5-2584317.pdf?src-supplier=Digi-Key
R268 = RES_0R_0603: ±1% 0Ω 0.1W 0603 Chip Resistor - Surface Mount ROHS; Manufacturer 1: Vishay/Dale; Manufacturer Part Number 1: CRCW06030000Z0EA; Tolerance: ±5%; Ratings: 1/10W; SCDType: spec; Package / Case: 0603 (1608metric); Supplier 1: Digi-Key; Supplier Part Number 1: 541-0.0GCT-ND; ComponentLink1URL: http://www.vishay.com/doc?20035; ComponentLink1Description: http://www.vishay.com/doc?20035; Supplier 2: Digi-Key; Supplier Part Number 2: P0.0GTR-ND; Manufacturer 2: Panasonic Electronic Components; Manufacturer Part Number 2: ERJ-3GEY0R00V; RoHS 2: RoHS Compliant; ComponentLink2URL: http://industrial.panasonic.com/www-cgi/jvcr13pz.cgi?E+PZ+3+AOA0001+ERJ3GEY0R00V+7+WW; ComponentLink2Description: http://industrial.panasonic.com/www-cgi/jvcr13pz.cgi?E+PZ+3+AOA0001+ERJ3GEY0R00V+7+WW; Supplier 3: Digi-Key; Supplier Part Number 3: 311-0.0LECT-ND; Manufacturer 3: Yageo; Manufacturer Part Number 3: AC0603JR-070RL; RoHS 3: RoHS Compliant; ComponentLink3URL: http://www.yageo.com/documents/recent/PYu-AC_51_RoHS_L_2.pdf; ComponentLink3Description: http://www.yageo.com/documents/recent/PYu-AC_51_RoHS_L_2.pdf; JLCPCB Part #: C21189
TP20-TP24 TP27-TP39 = TESTPOINT: SMD test pin
U4 U38 = PM-LINEREG-TC1014-IL5: 50 mA, 100 mA and 150 mA CMOS LDOs with Active-Low Shutdown and Reference Bypass, 5-Pin SOT-23, Extended Temperature, Tape and Reel; PackageVersion: revBB, Aug-2009; Code_IPC: SOT23-5; PackageDescription: 5-Lead Plastic Small Outline Transistor (CT) [SOT-23]; DatasheetVersion: revE, Feb-2007; PackageReference: SOT-23-CT5
U8 U21 U41 = CMP-0187-00454-2: 2.8 MHz, 150 Î¼A Op Amp, 5-Pin SOT-23, Extended Temperature Range, Tape and Reel; Code_IPC: SOT23-5; PackageDescription: 5-Lead Plastic Small Outline Transistor (OT) [SOT-23]; PackageReference: SOT-23-OT5; ComponentLink3URL: http://www.microchip.com/stellent/groups/techpub_sg/documents/packagingspec/en012702.pdf; ComponentLink1Description: Manufacturer URL; ComponentLink2URL: http://ww1.microchip.com/downloads/en/DeviceDoc/22145a.pdf; ComponentLink2Description: Datasheet; PackageVersion: revBB, Aug-2009; RevisionNote: URLs added.; ComponentLink1URL: http://www.microchip.com/; DatasheetVersion: revA, Mar-2009; ComponentLink3Description: Package Specification
U9 U20 U30 = CMP-0384-01693-1: Double Channel Single-Supply Operation Operational Amplifier, 110 MHz BW, 170 V/us SR, Industrial, 8-pin SOP (RM-8), Reel; Manufacturer: Analog Devices; PartNumber: AD8092ARMZ-REEL; Generic Part Number: AD8092; V Span Max: 12V; Amplifiers Per Package: 2; Input Bias Current: 1.3uA; Small Signal Bandwidth: 110MHz; Iq/Amp: 5.5mA; V Span Min: 3V; Input Offset Voltage: 1.6mV; DatasheetVersion: Rev. C; ComponentLink3Description: Package Specification; ComponentLink3URL: http://www.analog.com/static/imported-files/packages/PKG_PDF/MSOP%28RM%29/RM_8.pdf; ComponentLink1Description: Manufacturer URL; ComponentLink2URL: http://www.analog.com/static/imported-files/data_sheets/AD8091_8092.pdf; PackageReference: RM-8; Mounting Technology: Surface Mount; ComponentLink1URL: http://www.analog.com/en/index.html; Slew Rate: 170V/us; PackageDescription: 8-Pin Mini Small Outline Package, Body 3 x 3 mm, Pitch 0.65 mm; Code_JEDEC: MO-187-AA; ComponentLink2Description: Datasheet
U19 = AMP-OPA-MCP602-IL8: 2.8 MHz, 150 Î¼A Dual Op Amp, 8-Pin SOIC, Extended Temperature Range, Tape and Reel; ComponentLink2Description: Datasheet; Code_IPC: SOIC127P600-8; DatasheetVersion: revA, Mar-2009; Code_JEDEC: MS-012; ComponentLink3Description: Package Specification; PackageDescription: 8-Lead Plastic Small Outline (SN) - Narrow, 3.90mm Body [SOIC]; PackageVersion: revBB, Aug-2009; ComponentLink2URL: http://ww1.microchip.com/downloads/en/DeviceDoc/22145a.pdf; PackageReference: SOIC-SN8; ComponentLink3URL: http://www.microchip.com/stellent/groups/techpub_sg/documents/packagingspec/en012702.pdf; RevisionNote: URLs added.; ComponentLink1URL: http://www.microchip.com/; ComponentLink1Description: Manufacturer URL
U22 = ADI-ADR34xx-RJ-6: Micropower, High Accuracy Voltage Reference, 3.3 V Output, 3.5 to 5.5 V Supply, Industrial, 6-pin SOT23 (RJ-6), Reel; PartNumber: ADR3433ARJZ-R2; Manufacturer: Analog Devices; Ref Out TC (ppm/C): 8; Vout: 3.3V; Min V Supply (V): 3.5; Max V Supply (V): 5.5; Mounting Technology: Surface Mount; ComponentLink1URL: http://www.analog.com/en/index.html; ComponentLink1Description: Manufacturer URL; PackageVersion: 121608-A, 12/2008; Operating Temp Range: -40 to 125 degC; Packing: Reel; ComponentLink2Description: Datasheet; PackageDescription: 6-Pin Small Outline Transistor Package, Body 2.9 x 1.6 mm, Pitch 0.95 mm; ComponentLink4Description: URL Link1; ComponentLink3Description: Package Specification; Code_JEDEC: MO-178-AB; DatasheetVersion: Rev. B; PackageReference: RJ-6; ComponentLink4URL: Product URL:http://www.analog.com/en/special-linear-functions/voltage-references/adr3433/products/product.html; ComponentLink3URL: http://www.analog.com/static/imported-files/packages/PKG_PDF/SOT-23(RJ)/RJ_6.pdf; ComponentLink2URL: http://www.analog.com/static/imported-files/data_sheets/ADR3412_ADR3420_ADR3425_ADR3430_ADR3433_ADR3440_ADR3450.pdf
U32 = STM32G491CCU: Manufacturer: STMicroelectronics; Manufacturer Part Number: STM32G491CCU6; Supplier 1: Digi-Key; RoHS: Yes